# EAGLE design TBA820-Module-KOSMOS (EAGLE 7.2.0)
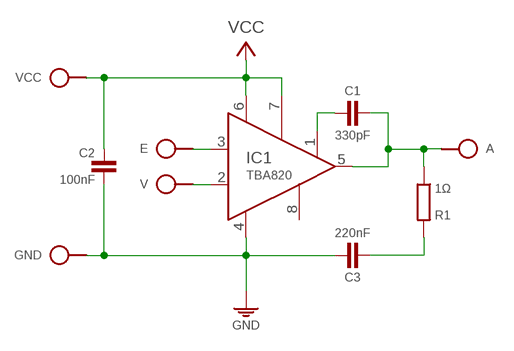
[diagram p0: schematic, sheet 1]

## Parts
A  SPAD  [SPAD]
C1  330pF  C-H050-020X044  [C050-020X044]
C2  100nF  C075-035X050  [C075-035X050]
C3  220nF  C-H050-020X044  [C050-020X044]
E  SPAD  [SPAD]
GND  SPAD  [SPAD]
IC1  TBA820  [DIL08]
R1  1Ω  R0204/10  [0204/10]
V  SPAD  [SPAD]
VCC  SPAD  [SPAD]

## Nets
GND: C2.2 C3.2 GND.1 IC1.4(GND)
N$2: C1.1 IC1.1(FREQ)
N$3: A.1 C1.2 IC1.5(OUT) R1.2
N$5: E.1 IC1.3(INPUT)
N$6: C3.1 R1.1
N$7: IC1.2(GAIN) V.1
VCC: C2.1 IC1.6(VCC) IC1.7(BOOT) VCC.1
Unconnected: IC1.8(RIPPLE)

## Library data of the parts
A E GND V VCC = pad:SPAD
C1 C3 = c:C-H
C2 = c:C: CAPACITOR, European symbol
IC1 = ic:TBA820
R1 = r:R: RESISTOR, European symbol

## Net classes
0 default: width 0.813 mm

## Board
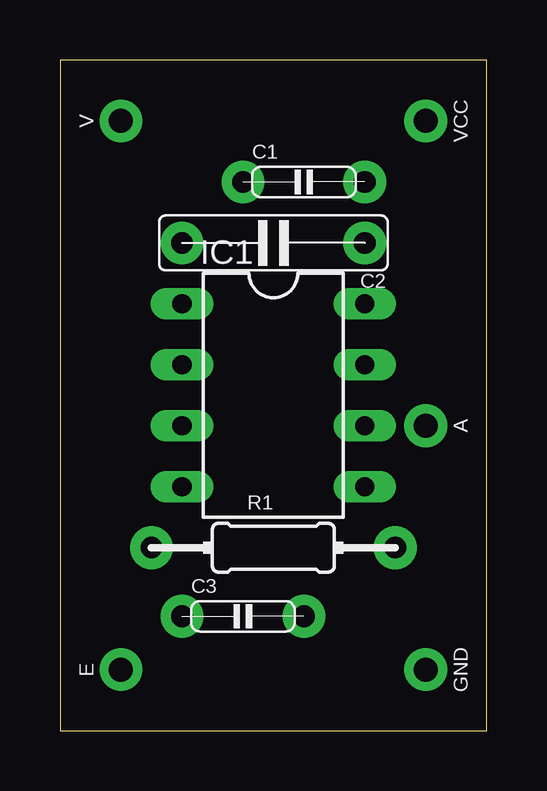
[diagram p1: board, top side]
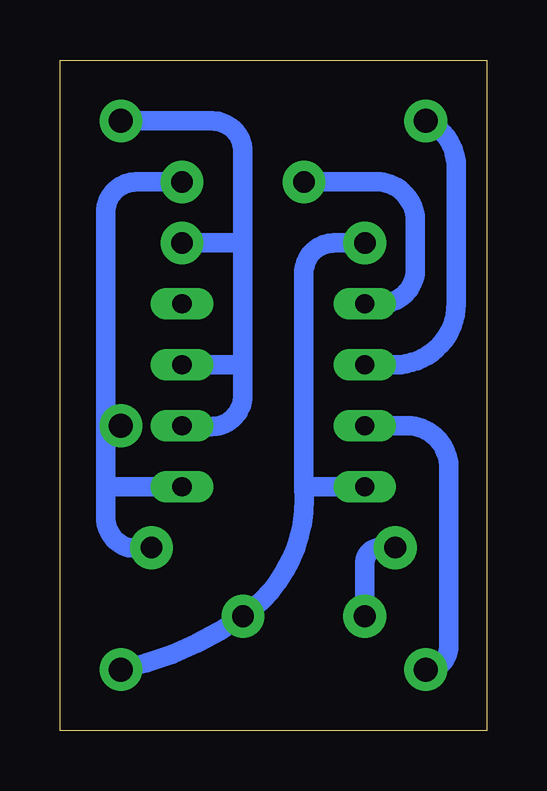
[diagram p2: board, bottom side, seen from below]

Size 17.78 x 27.94 mm. Coordinates in mm from the lower left corner, seen from the top.
Outline: 0,0 17.78,0 17.78,27.94 0,27.94 0,0
Copper layers (1*16): Top 0.035mm / dielectric 1.5mm / Bottom 0.035mm
Design rules "default": minimum track width 10mil, minimum drill 24mil, track to track 8mil, track to pad 8mil, pad to pad 8mil, via to via 8mil, smd to smd 8mil, copper to edge 40mil, drill to drill 8mil, minimum pad ring 10mil, minimum via ring 8mil, stop-mask expansion 4mil, vias tented up to drill 0mil, thermal gap 10mil

### Footprints (pad centres in the part's own frame; a part is rotated, then mirrored left to right if it is on the bottom)
SPAD = drill 1 pad 1.778: 1 0,0
C050-020X044 = drill 0.9 pad 1.778: 1 -2.54,0; 2 2.54,0
C075-035X050 = drill 0.9 pad 1.778: 1 -3.81,0; 2 3.81,0
DIL08 = drill 0.8 pad 1.27 long: 1 -3.81,3.81; 2 -3.81,1.27; 3 -3.81,-1.27; 4 -3.81,-3.81; 5 3.81,-3.81; 6 3.81,-1.27; 7 3.81,1.27; 8 3.81,3.81
0204/10 = drill 0.9 pad 1.778: 1 -5.08,0; 2 5.08,0

### Placement (x,y rotation side)
A  15.24,12.7 180 top
C1  10.16,22.86 0 top
C2  8.89,20.32 180 top
C3  7.62,4.76 0 top
E  2.54,2.54 0 top
GND  15.24,2.54 180 top
IC1  8.89,13.97 0 top
R1  8.89,7.62 0 top
V  2.54,25.4 0 top
VCC  15.24,25.4 180 top

### Tracks (layer width: path | path; a pad name or v marks a point on that pad's centre or on a via)
GND
  Bottom 0.813: C2.2 6.35,20.32 arc-90 7.62,19.05 7.62,10.16 | GND.1 arc-22 C3.2 arc-60 7.62,10.16 | 7.62,10.16 IC1.4
N$2
  Bottom 0.813: IC1.1 4.45,17.78 arc-84 2.98,19.05 2.98,21.4 arc-90 4.76,22.86 | 4.76,22.86 4.57,22.86 | 4.76,22.86 C1.1
N$3
  Bottom 0.813: 15.88,10.16 15.88,8.89 arc-74 14.92,7.62 R1.2 | IC1.5 15.88,10.16 | 15.88,12.7 15.88,21.59 arc90 14.61,22.86 C1.2 | 15.88,10.16 15.88,12.7 | 15.88,12.7 A.1
N$5
  Bottom 0.813: E.1 arc-90 1.59,3.49 1.59,11.11 arc-90 3.49,12.7 IC1.3
N$6
  Bottom 0.813: C3.1 5.08,6.98 arc90 4.45,7.62 R1.1
N$7
  Bottom 0.813: IC1.2 3.81,15.24 arc-90 1.27,17.78 1.27,23.5 arc-67 V.1
VCC
  Bottom 0.813: 10.16,15.24 10.16,20.32 | IC1.6 11.75,12.7 arc-103 10.16,13.97 10.16,15.24 | 10.16,15.24 IC1.7 | C2.1 10.16,20.32 | 10.16,20.32 10.16,24.13 arc-90 11.43,25.4 VCC.1